# Altium project IMX290_Module.PrjPcb
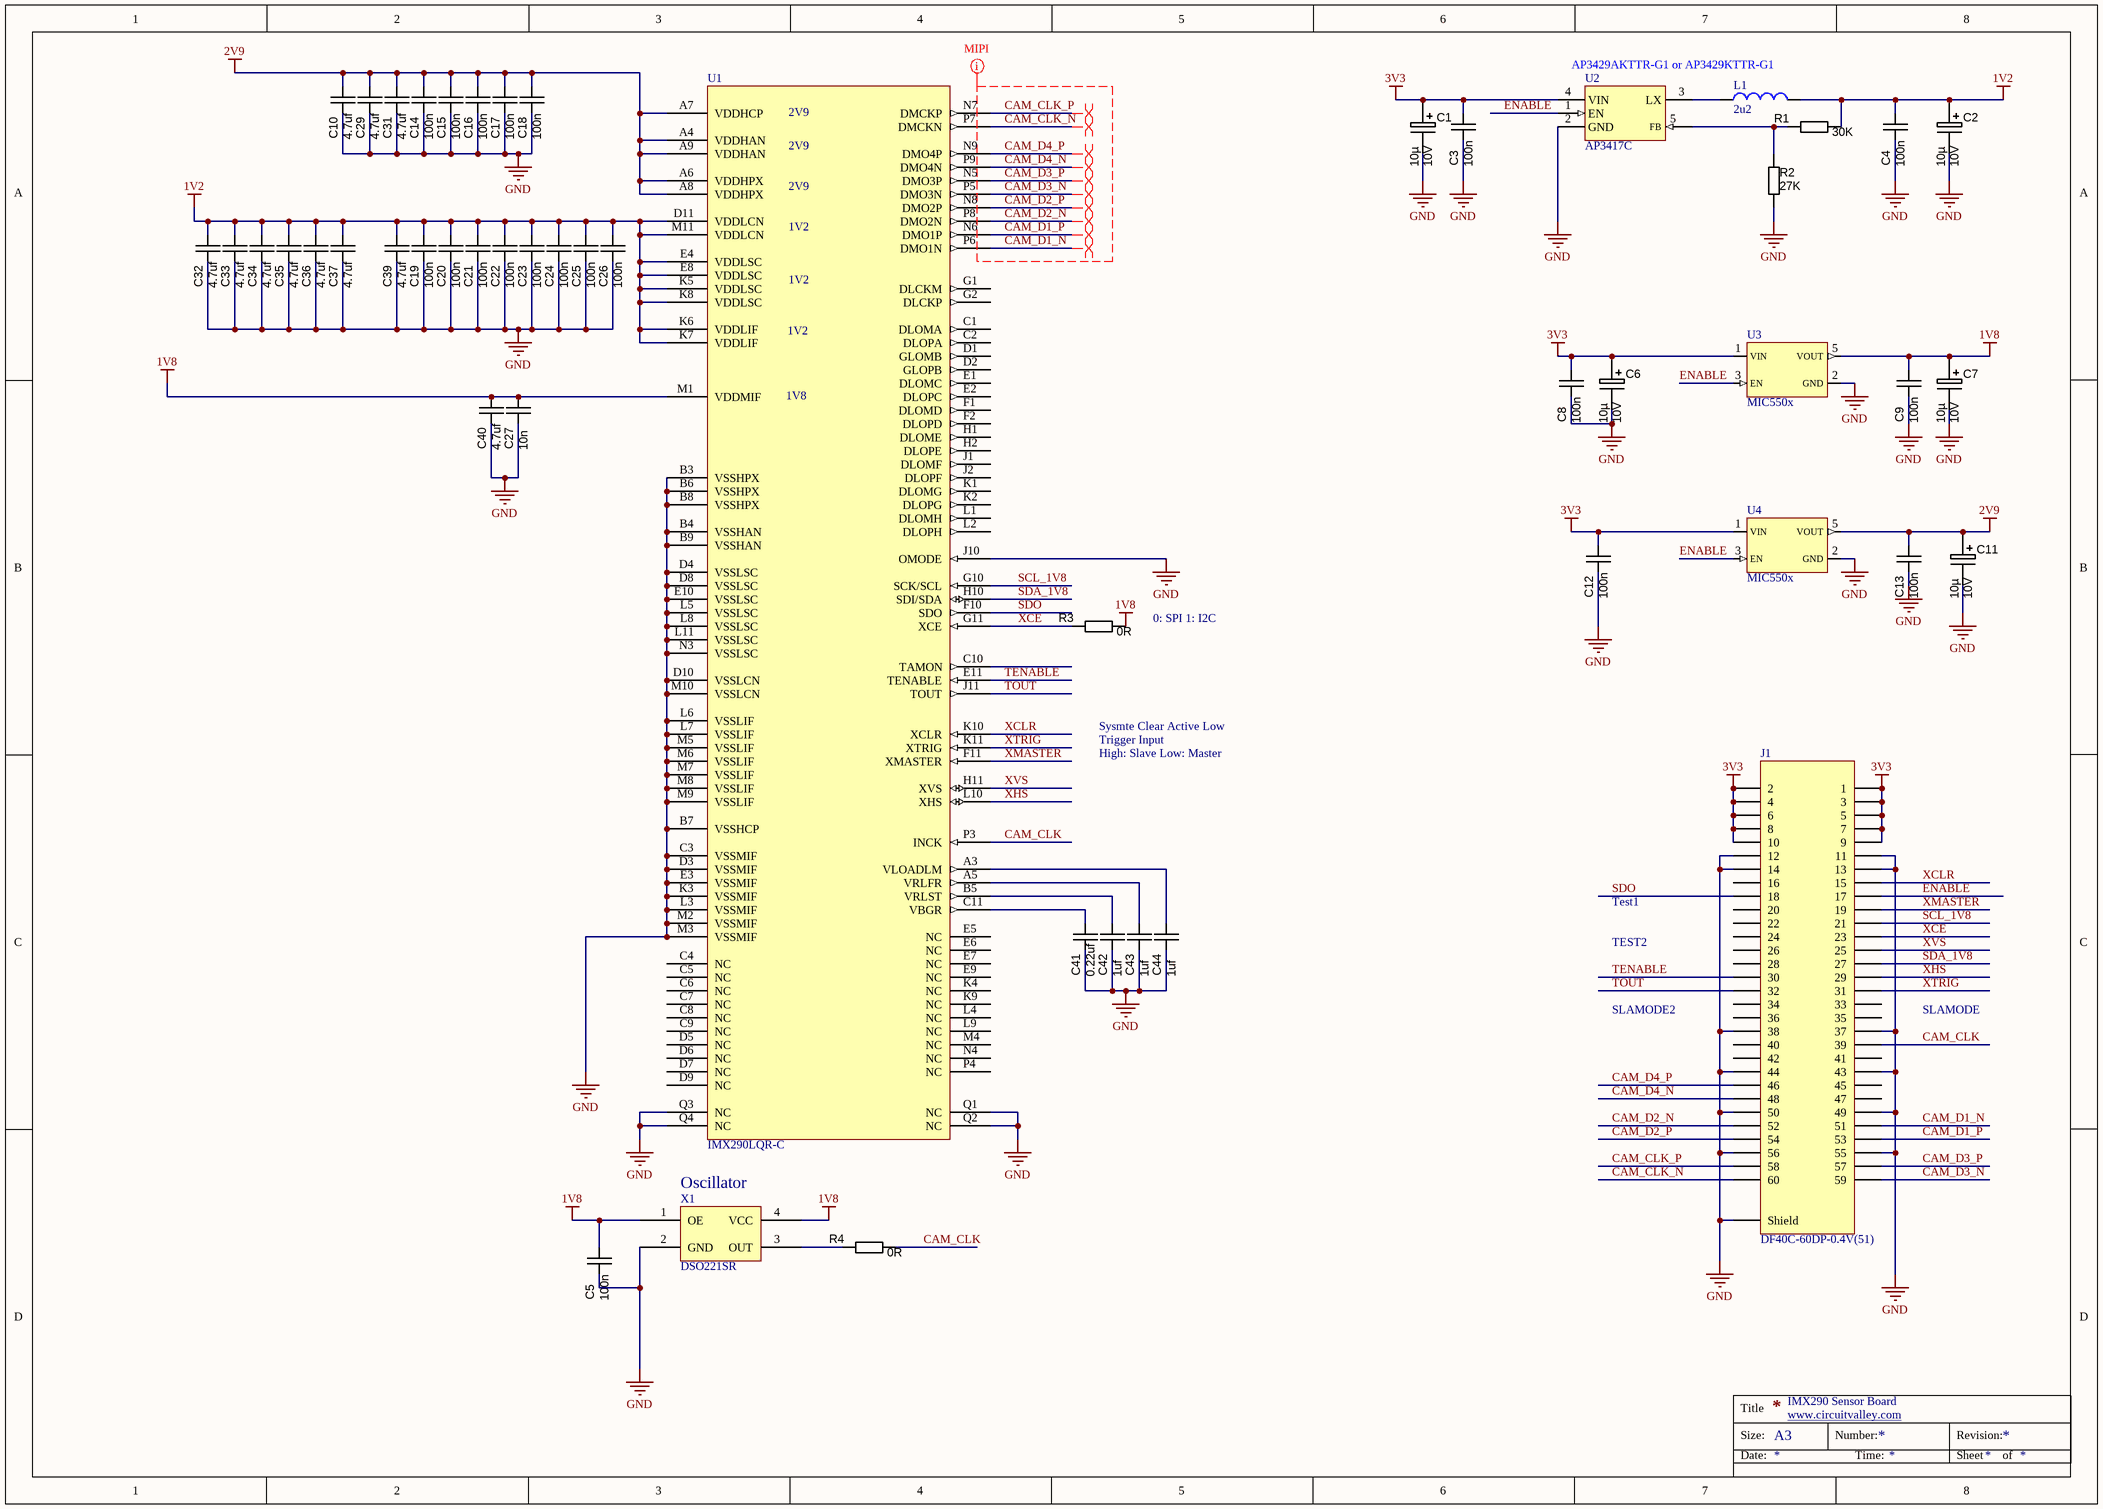
[diagram p0: IMX290_module_sch.SchDoc]
1 sheet, 52 parts. Net scope: global (net labels, ports and power ports of the same name join across sheets).
Board file: IMX290_module_pcb.PcbDoc

## Sheet IMX290_module_sch.SchDoc
size A3

### Parts
C1  Ratings: 10V  [CAPMP3528X210N]  (hidden comment: 10µ)
C2  Ratings: 10V  [CAPMP3528X210N]  (hidden comment: 10µ)
C3  100n  [CAPC1608N]
C4  100n  [CAPC1608N]
C5  100n  [CAPC1608N]
C6  Ratings: 10V  [CAPMP3528X210N]  (hidden comment: 10µ)
C7  Ratings: 10V  [CAPMP3528X210N]  (hidden comment: 10µ)
C8  100n  [CAPC1608N]
C9  100n  [CAPC1608N]
C10  4.7uf  [CAPC1608N]
C11  Ratings: 10V  [CAPMP3528X210N]  (hidden comment: 10µ)
C12  100n  [CAPC1608N]
C13  100n  [CAPC1608N]
C14  100n  [CAPC1608N]
C15  100n  [CAPC1608N]
C16  100n  [CAPC1608N]
C17  100n  [CAPC1608N]
C18  100n  [CAPC1608N]
C19  100n  [CAPC1608N]
C20  100n  [CAPC1608N]
C21  100n  [CAPC1608N]
C22  100n  [CAPC1608N]
C23  100n  [CAPC1608N]
C24  100n  [CAPC1608N]
C25  100n  [CAPC1608N]
C26  100n  [CAPC1608N]
C27  10n  [CAPC1608N]
C29  4.7uf  [CAPC1608N]
C31  4.7uf  [CAPC1608N]
C32  4.7uf  [CAPC1608N]
C33  4.7uf  [CAPC1608N]
C34  4.7uf  [CAPC1608N]
C35  4.7uf  [CAPC1608N]
C36  4.7uf  [CAPC1608N]
C37  4.7uf  [CAPC1608N]
C39  4.7uf  [CAPC1608N]
C40  4.7uf  [CAPC1608N]
C41  0.22uf  [CAPC1608N]
C42  1uf  [CAPC1608N]
C43  1uf  [CAPC1608N]
C44  1uf  [CAPC1608N]
J1  DF40C-60DP-0.4V(51)  [DF40C-60DP-0.4V]
L1  2u2  [TAIYO_NRS4018T2R2MDGJ]
R1  value 30K  [RESC1608N_ZERO]  (hidden comment: Thick Film)
R2  value 27K  [RESC1608N_ZERO]  (hidden comment: Thick Film)
R3  value 0R  [RESC1608N_ZERO]  (hidden comment: Thick Film)
R4  value 0R  [RESC1608N_ZERO]  (hidden comment: Thick Film)
U1  IMX290LQR-C  [IMX290LQR-C]
U2  AP3417C  [SOT23-5]
U3  MIC550x  [SOT23-5]
U4  MIC550x  [SOT23-5]
X1  DSO221SR  [Active Oscillator 2520]

### Nets
1V2: C2.1 C4.2 C19.2 C20.2 C21.2 C22.2 C23.2 C24.2 C25.2 C26.2 C32.2 C33.2 C34.2 C35.2 C36.2 C37.2 C39.2 L1.2 R1.1 U1.D11(VDDLCN) U1.E4(VDDLSC) U1.E8(VDDLSC) U1.K5(VDDLSC) U1.K6(VDDLIF) U1.K7(VDDLIF) U1.K8(VDDLSC) U1.M11(VDDLCN)
1V8: C5.2 C7.1 C9.2 C27.2 C40.2 R3.1 U1.M1(VDDMIF) U3.5(VOUT) X1.1(OE) X1.4(VCC)
2V9: C10.2 C11.1 C13.2 C14.2 C15.2 C16.2 C17.2 C18.2 C29.2 C31.2 U1.A4(VDDHAN) U1.A6(VDDHPX) U1.A7(VDDHCP) U1.A8(VDDHPX) U1.A9(VDDHAN) U4.5(VOUT)
3V3: C1.1 C3.2 C6.1 C8.2 C12.2 J1.1 J1.2 J1.3 J1.4 J1.5 J1.6 J1.7 J1.8 J1.9 J1.10 U2.4(VIN) U3.1(VIN) U4.1(VIN)
GND: C1.2 C2.2 C3.1 C4.1 C5.1 C6.2 C7.2 C8.1 C9.1 C10.1 C11.2 C12.1 C13.1 C14.1 C15.1 C16.1 C17.1 C18.1 C19.1 C20.1 C21.1 C22.1 C23.1 C24.1 C25.1 C26.1 C27.1 C29.1 C31.1 C32.1 C33.1 C34.1 C35.1 C36.1 C37.1 C39.1 C40.1 C41.1 C42.1 C43.1 C44.1 J1.11 J1.12 J1.13 J1.14 J1.37 J1.38 J1.43 J1.44 J1.49 J1.50 J1.55 J1.56 J1.S1(Shield) R2.2 U1.B3(VSSHPX) U1.B4(VSSHAN) U1.B6(VSSHPX) U1.B7(VSSHCP) U1.B8(VSSHPX) U1.B9(VSSHAN) U1.C3(VSSMIF) U1.D3(VSSMIF) U1.D4(VSSLSC) U1.D8(VSSLSC) U1.D10(VSSLCN) U1.E3(VSSMIF) U1.E10(VSSLSC) U1.J10(OMODE) U1.K3(VSSMIF) U1.L3(VSSMIF) U1.L5(VSSLSC) U1.L6(VSSLIF) U1.L7(VSSLIF) U1.L8(VSSLSC) U1.L11(VSSLSC) U1.M2(VSSMIF) U1.M3(VSSMIF) U1.M5(VSSLIF) U1.M6(VSSLIF) U1.M7(VSSLIF) U1.M8(VSSLIF) U1.M9(VSSLIF) U1.M10(VSSLCN) U1.N3(VSSLSC) U1.Q1(NC) U1.Q2(NC) U1.Q3(NC) U1.Q4(NC) U2.2(GND) U3.2(GND) U4.2(GND) X1.2(GND)
CAM_CLK: J1.39 R4.1 U1.P3(INCK)
CAM_CLK_N: J1.60 U1.P7(DMCKN)
CAM_CLK_P: J1.58 U1.N7(DMCKP)
CAM_D1_N: J1.51 U1.P6(DMO1N)
CAM_D1_P: J1.53 U1.N6(DMO1P)
CAM_D2_N: J1.52 U1.P8(DMO2N)
CAM_D2_P: J1.54 U1.N8(DMO2P)
CAM_D3_N: J1.59 U1.P5(DMO3N)
CAM_D3_P: J1.57 U1.N5(DMO3P)
CAM_D4_N: J1.48 U1.P9(DMO4N)
CAM_D4_P: J1.46 U1.N9(DMO4P)
ENABLE: J1.17 U2.1(EN) U3.3(EN) U4.3(EN)
SCL_1V8: J1.21 U1.G10(SCK/SCL)
SDA_1V8: J1.27 U1.H10(SDI/SDA)
SDO: J1.18 U1.F10(SDO)
TENABLE: J1.30 U1.E11(TENABLE)
TOUT: J1.32 U1.J11(TOUT)
XCE: J1.23 R3.2 U1.G11(XCE)
XCLR: J1.15 U1.K10(XCLR)
XHS: J1.29 U1.L10(XHS)
XMASTER: J1.19 U1.F11(XMASTER)
XTRIG: J1.31 U1.K11(XTRIG)
XVS: J1.25 U1.H11(XVS)
NetC41_2: C41.2 U1.C11(VBGR)
NetC42_2: C42.2 U1.B5(VRLST)
NetC43_2: C43.2 U1.A5(VRLFR)
NetC44_2: C44.2 U1.A3(VLOADLM)
NetL1_1: L1.1 U2.3(LX)
NetR1_2: R1.2 R2.1 U2.5(FB)
NetR4_2: R4.2 X1.3(OUT)

Not connected (* = marked no-connect by the designer): J1 16 20 22 24 26 28 33 34 35 36 40 41 42 45 47; U1 C1(DLOMA) C2(DLOPA) C4(NC) C5(NC) C6(NC) C7(NC) C8(NC) C9(NC) C10(TAMON) D1(GLOMB) D2(GLOPB) D5(NC) D6(NC) D7(NC) D9(NC) E1(DLOMC) E2(DLOPC) E5(NC) E6(NC) E7(NC) E9(NC) F1(DLOMD) F2(DLOPD) G1(DLCKM) G2(DLCKP) H1(DLOME) H2(DLOPE) J1(DLOMF) J2(DLOPF) K1(DLOMG) K2(DLOPG) K4(NC) K9(NC) L1(DLOMH) L2(DLOPH) L4(NC) L9(NC) M4(NC) N4(NC) P4(NC)

### Layout directives
differential pair: CAM_CLK_N, CAM_CLK_P, CAM_D1_N, CAM_D1_P, CAM_D2_N, CAM_D2_P, CAM_D3_N, CAM_D3_P, CAM_D4_N, CAM_D4_P
net class MIPI: CAM_CLK_N, CAM_CLK_P, CAM_D1_N, CAM_D1_P, CAM_D2_N, CAM_D2_P, CAM_D3_N, CAM_D3_P, CAM_D4_N, CAM_D4_P

### Notes on the sheet
- AP3429AKTTR-G1 or AP3429KTTR-G1
- (near R3) 0: SPI 1: I2C
- Sysmte Clear Active Low
- High: Slave Low: Master
- Trigger Input
- Test1
- TEST2
- SLAMODE2
- SLAMODE
- (near X1) Oscillator
- IMX290 Sensor Board
- www.circuitvalley.com <http://www.circuitvalley.com>
- Title
- Size:
- Date:
- A3
- Number:
- Time:
- Revision:
- Sheet
- of
- (in symbol IMX290LQR-C) 2V9; 1V2; 1V8

### Library data of the parts
C1 C2 C6 C7 C11 = CAPT_47u_1210_6V3: Capacitor SMD Tantalum 47uF 20% 6.3V 1210; Manufacturer 1: AVX Corporation; Manufacturer Part Number 1: TCJB476M006R0070; Manufacturer Size Code: B; Voltage - Rated: 6V3; ESR (Equivalent Series Resistance): 70.0 mOhm; Type: Molded; Package / Case: 1210 (3528 Metric); Tolerance: ±20%; Material: Tantalum; Supplier 1: Digi-Key; Supplier Part Number 1: 478-3139-1-ND; Operating Temperature: -55°C ~ 125°C; Size / Dimension: 0.138" L x 0.110" W (3.50mm x 2.80mm); Height - Seated (Max): 0.083" (2.10mm); ComponentLink1URL: http://www.avx.com/docs/Catalogs/tcj.pdf; ComponentLink1Description: http://www.avx.com/docs/Catalogs/tcj.pdf; Value: 10µ
C3-C5 C8-C10 C12-C27 C29 C31-C37 C39-C44 = CAPC_10p_0603_NP0_1%_50V: Capacitor SMD Cer 10pF 5% 50V NP0 0603; Manufacturer 1: Murata Electronics North America; Manufacturer Part Number 1: GRM1885C1H100FA01J; Part: C0603X104K5RAC; Ratings: 50V; NP0; Tolerance: ±5%; Operating Temperature: -55°C ~ 125°C; Package / Case: 0603 (1608 Metric); Size / Dimension: 0.063" L x 0.032" W (1.60mm x 0.81mm); Thickness (Max): 0.035" (0.90mm); Supplier 1: Digi-Key; Supplier Part Number 1: GRM1885C1H100FA01J-ND
  C3-C5 C8 C9 C12-C26: Value: 100n
  C10 C29 C31-C37 C39 C40: Value: 4.7uf
  C27: Value: 10n
  C41: Value: 0.22uf
  C42-C44: Value: 1uf
J1 = LSHM-130-xx: Samtec 0.5mm 60 pin Connector
L1 = inductor_smd: PartNumber: NRS4018T2R2MDGJ
R1-R4 = RES_0R_0603: Resistor SMD chip 0.0 Ohm 0.1W 0603; Manufacturer 1: Vishay/Dale; Manufacturer Part Number 1: CRCW06030000Z0EA; Tolerance: ±5%; Ratings: 1/10W; Package / Case: 0603 (1608metric); Supplier 1: Digi-Key; Supplier Part Number 1: 541-0.0GCT-ND
U1 = IMX290LQR-C: Sony Color Image senosr
X1 = Oscillator_2520: Active Oscillator_2520